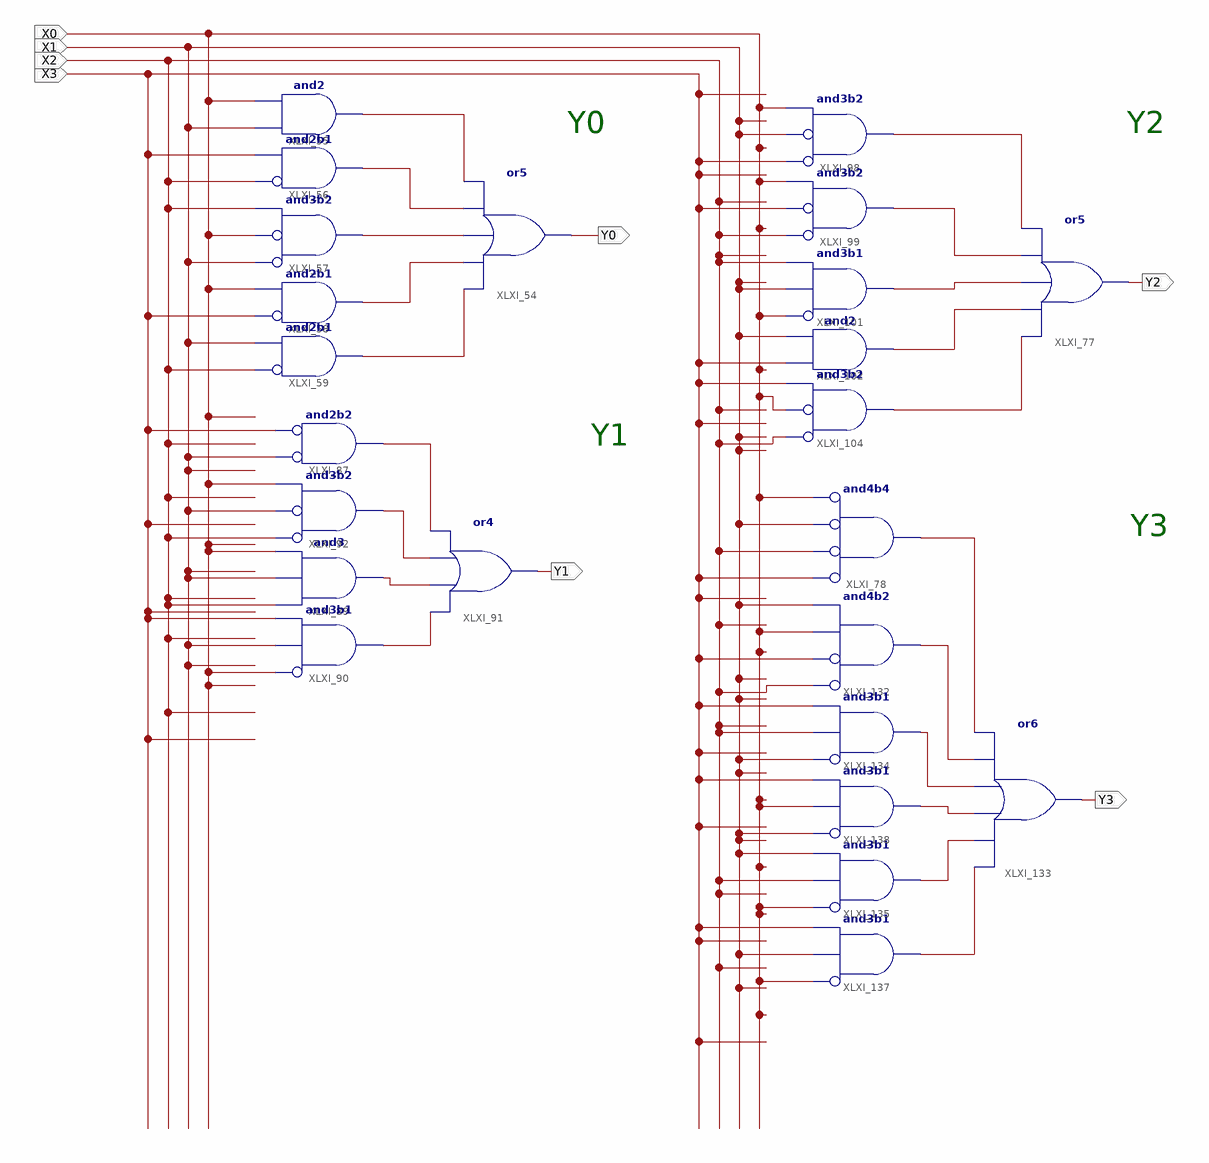
[diagram p0: schematic sheet 1]
// Xilinx ISE schematic LR1_DNF.sch (artix7) as structural Verilog: 24 symbols, 8 ports
module LR1_DNF (
  input  X3,
  input  X2,
  input  X1,
  input  X0,
  output Y0,
  output Y1,
  output Y2,
  output Y3
);

  wire XLXN_63, XLXN_64, XLXN_65, XLXN_66, XLXN_67, XLXN_104, XLXN_105, XLXN_107, XLXN_110, XLXN_119,
       XLXN_120, XLXN_121, XLXN_122, XLXN_123, XLXN_132, XLXN_133, XLXN_134, XLXN_135, XLXN_136, XLXN_137;

  and XLXI_55 (XLXN_65, X1, X0);
  and XLXI_56 (XLXN_64, ~X2, X3);  // and2b1
  and XLXI_57 (XLXN_63, ~X1, ~X0, X2);  // and3b2
  and XLXI_58 (XLXN_66, ~X3, X0);  // and2b1
  and XLXI_59 (XLXN_67, ~X2, X1);  // and2b1
  or XLXI_54 (Y0, XLXN_67, XLXN_66, XLXN_63, XLXN_64, XLXN_65);
  or XLXI_77 (Y2, XLXN_121, XLXN_120, XLXN_119, XLXN_122, XLXN_123);
  and XLXI_87 (XLXN_104, ~X1, ~X3);  // and2b2
  and XLXI_89 (XLXN_107, X2, X1, X0);
  and XLXI_90 (XLXN_110, ~X0, X1, X3);  // and3b1
  or XLXI_91 (Y1, XLXN_110, XLXN_107, XLXN_105, XLXN_104);
  and XLXI_92 (XLXN_105, ~X2, ~X1, X0);  // and3b2
  and XLXI_98 (XLXN_123, ~X3, ~X1, X0);  // and3b2
  and XLXI_99 (XLXN_122, ~X2, ~X3, X0);  // and3b2
  and XLXI_101 (XLXN_119, ~X0, X1, X2);  // and3b1
  and XLXI_102 (XLXN_120, X3, X1);
  and XLXI_104 (XLXN_121, ~X2, ~X0, X3);  // and3b2
  and XLXI_78 (XLXN_132, ~X3, ~X2, ~X1, ~X0);  // and4b4
  and XLXI_132 (XLXN_133, ~X2, ~X3, X0, X1);  // and4b2
  or XLXI_133 (Y3, XLXN_137, XLXN_136, XLXN_135, XLXN_134, XLXN_133, XLXN_132);
  and XLXI_134 (XLXN_134, ~X1, X2, X3);  // and3b1
  and XLXI_135 (XLXN_136, ~X0, X2, X1);  // and3b1
  and XLXI_137 (XLXN_137, ~X0, X1, X3);  // and3b1
  and XLXI_138 (XLXN_135, ~X1, X0, X3);  // and3b1

  // Notes on the sheet:
  //   Y0
  //   Y2
  //   Y1
  //   Y3
endmodule
